# Altium schematic sheet AD_GIT_TEST.SchDoc
size A3
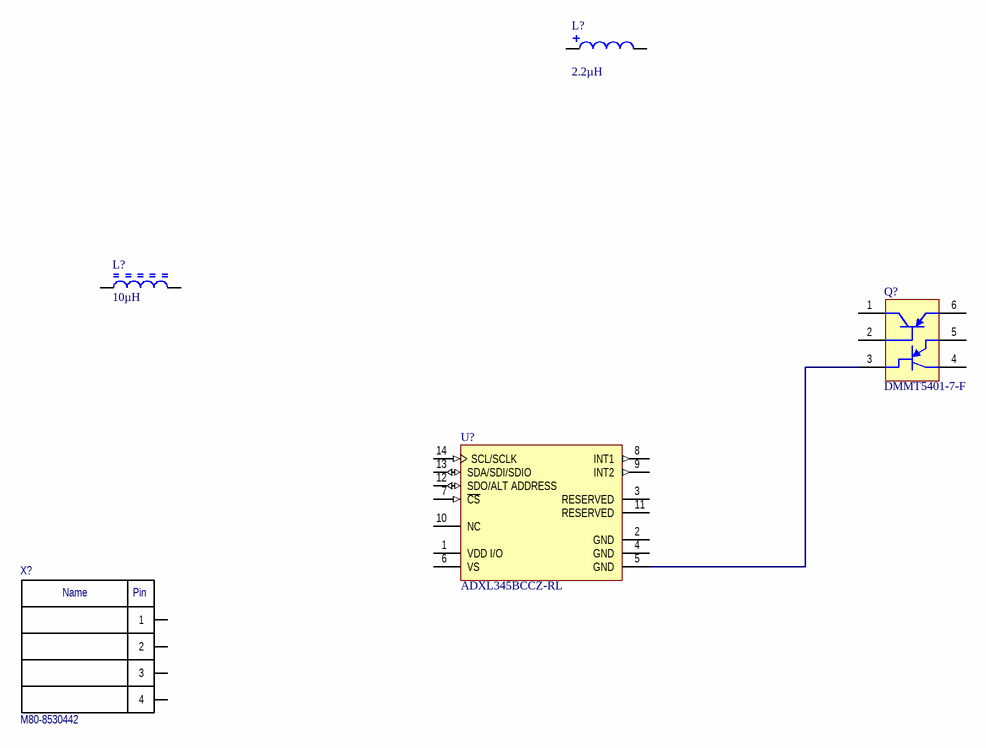
[diagram p0: AD_GIT_TEST.SchDoc]

## Parts
(Parts that share a designator on the sheet are numbered #1, #2 ... from top to bottom, then left to right.)
L?#1  Inductance: 2.2µH  [INDC1005X55X25ML5T10]  (hidden comment: LQG15HN2N2S02D)
L?#2  Inductance: 10µH  [BOUR-CM322522_V]  (hidden comment: CM322522-100KL)
Q?  DMMT5401-7-F  [DIOD-SOT-26-6_M]
U?  ADXL345BCCZ-RL  [ADI-CC-14-1_V]
X?  M80-8530442  [HARWIN_M80-8530442]

## Nets
NetQ?_3: Q?.3(B2) U?.5(GND)

Not connected (* = marked no-connect by the designer): L?#1 1 2; L?#2 1 2; Q? 1(C1) 2(B1) 4(C2) 5(E2) 6(E1); U? 1(VDD_I/O) 2(GND) 3(RESERVED) 4(GND) 6(VS) 7(~{CS}) 8(INT1) 9(INT2) 10(NC) 11(RESERVED) 12(SDO/ALT_ADDRESS) 13(SDA/SDI/SDIO) 14(SCL/SCLK); X? 1 2 3 4

## Notes on the sheet
- Name
- PCBA Number:
- PCB Number:
- Revision:
- THOMMEN AIRCRAFT EQUIPMENT AG
- Hofackerstrasse 48
- 4132 Muttenz
- Switzerland
- Drawn by:
- Checked by:
- Signature
- Date:
- Description:
- Approved by:
- Print Date:
- Sheet
- of
- Size: A3
- (in symbol CON_M80-8530442) Name; Pin

## Library data of the parts
L?#1 = CMP-006-00007-2: Chip Inductor, 2.2 nH, +/- 0.3 nH, 300 mA, -55 to 125 degC, 0402 (1005 Metric), RoHS, Tape and Reel; Manufacturer: Murata; Resistance: 0.15Ohm; Self Resonant Frequency: 6GHz; Tolerance: 5%; Current Rating: 300mA; Q Factor: 8; Core Material: Air; Shielding: Unshielded; Package Reference: 0402; Case/Package: 0402; Packaging: TapeandReel; Max Operating Temperature: 125°C; RoHS Compliant: True; Package Description: 2-Pin Surface Mount Device, Body 1 x 0.5 mm; Min Operating Temperature: -55°C; Mounting Technology: SM; Pins: 2; Datasheet URL: http://industrial.panasonic.com/cdbs/www-data/pdf/AGA0000/AGA0000C49.pdf; Package Quantity: 10000; Datasheet Version: Sep-10
L?#2 = CMP-006-00005-2: Chip Inductor, 10 uH, +/- 10%, -40 to 125 degC, 1210 (3225 Metric), RoHS, Tape and Reel; Manufacturer: Bourns; Q Factor: 30; Core Material: Ferrite; Self Resonant Frequency: 30MHz; Resistance: 2.1Ohm; Current Rating: 140mA; Shielding: Unshielded; Inductance Tolerance: 10%; Case/Package: 1210; Packaging: TapeandReel; Package Description: 2-Pin Surface Mount Device, Body 3.2 x 2.5 mm; Min Operating Temperature: -20°C; Datasheet URL: http://www.murata.com/~/media/webrenewal/support/library/catalog/products/emc/emifil/c30e.ashx?la=en-gb; Package Quantity: 1; RoHS Compliant: True; Datasheet Version: Aug-14; Package Reference: 1210; Pins: 2; Max Operating Temperature: 100°C; Tolerance: 10%; Mounting Technology: SM
Q? = CMP-013-00006-2: Matched PNP Small Signal Surface Mount Transistor, 300 mW, -55 to 150 degC, 6-Pin SOT-26, RoHS, Tape and Reel; Manufacturer: Diodes Inc; Elements: 2; hFE Min: 60; Power: 300mW; Frequency: 300MHz; Vce Max: 500mV; Datasheet URL: http://www.diodes.com/_files/datasheets/ds30437.pdf; RoHS Compliant: True; Min Operating Temperature: -55°C; Package Description: 6-Pin Small Outline Transistor, Body 1.6 x 3 mm, Pitch 0.95 mm; Case/Package: SOT-26; Pins: 6; Package Reference: SOT-26-6; Package Quantity: 3000; Datasheet Version: Rev. 6-2, 05/2009; Packaging: TapeandReel; Max Operating Temperature: 150°C; Mounting Technology: SM
U? = CMP-010-00001-2: 3-Axis, +/-2 g / +/-4 g / +/-8 g / +/-16 g Digital Accelerometer with Digital Output, 1.6 KHz BW, -40 to 85 degC, 14-Pin LGA, Reel; Manufacturer: Analog Devices; Interface: Serial; Max Supply Voltage: 3.6V; Package Version: 03-16-2010-A, 03/2010; Min Supply Voltage: 2V; Nominal Supply Current: 140uA; Sensor Type: Motion; Nominal Supply Voltage: 2.5V; Package Quantity: 5000; Packaging: TapeandReel; Min Operating Temperature: -40°C; RoHS Compliant: True; Package Reference: CC-14-1; Max Operating Temperature: 85°C; Package Description: 14-Pin Land Grid Array, 3 x 5 mm Body, 0.8 mm Pitch; Datasheet URL: http://www.analog.com/static/imported-files/data_sheets/ADXL345.pdf; Pins: 14; Mounting Technology: SM; Case/Package: LGA; Datasheet Version: Rev. E, 06/2015
X? = CON_M80-8530442: Connector Header Through Hole 4 position 0.079" (2.00mm); Manufacturer: Harwin; Group: CON; Value: *; Package: *; PartNumber: M80-8530442; ComponentLink2Description: Datasheet; ComponentLink2URL: https://cdn.harwin.com/pdfs/M80-853.pdf